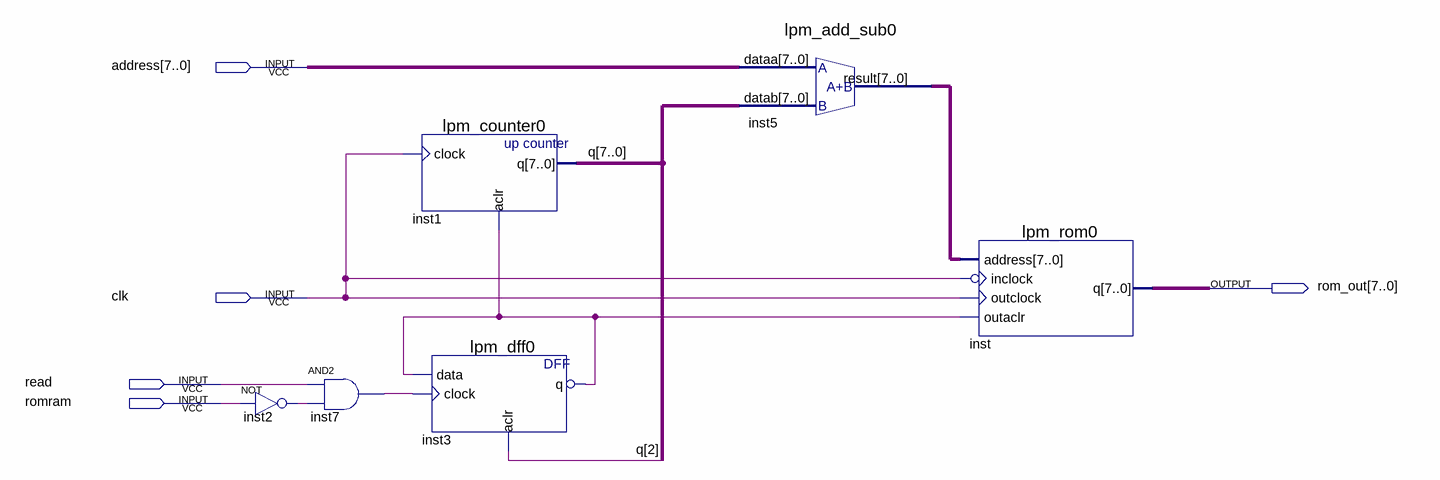
[diagram p0: schematic sheet]
// Quartus schematic rom.bdf as structural Verilog: 6 symbols, 5 pins
module rom (
  input  [7:0] address,
  input  clk,
  input  read,
  input  romram,
  output [7:0] rom_out
);

  wire inst2_out, inst3_q, inst3_q_inverted_out, inst7_out;
  wire [7:0] inst5_result, q;

  not inst2 (inst2_out, romram);
  and inst7 (inst7_out, read, inst2_out);
  lpm_counter0 inst1 (.clock(clk), .aclr(inst3_q_inverted_out), .q(q));
  lpm_dff0 inst3 (.data(inst3_q_inverted_out), .clock(inst7_out), .aclr(q[2]), .q(inst3_q));
  not inst3_q_inverted (inst3_q_inverted_out, inst3_q);
  lpm_add_sub0 inst5 (.dataa(address), .datab(q), .result(inst5_result));
  lpm_rom0 inst (.address(inst5_result), .inclock(~clk), .outclock(clk), .outaclr(inst3_q_inverted_out), .q(rom_out));
endmodule
